# Altium project RTU_LMG.PrjPcb (part 2 of 3)

## Sheet RTU_LMG_Linear_Voltage_Regulator_3V3.SchDoc
size A; Organization: Altium Limited; Address1: L3, 12a Rodborough Rd; Address2: Frenchs Forest; Address3: NSW; Address4: Australia 2086; SheetNumber: 3; SheetTotal: 17
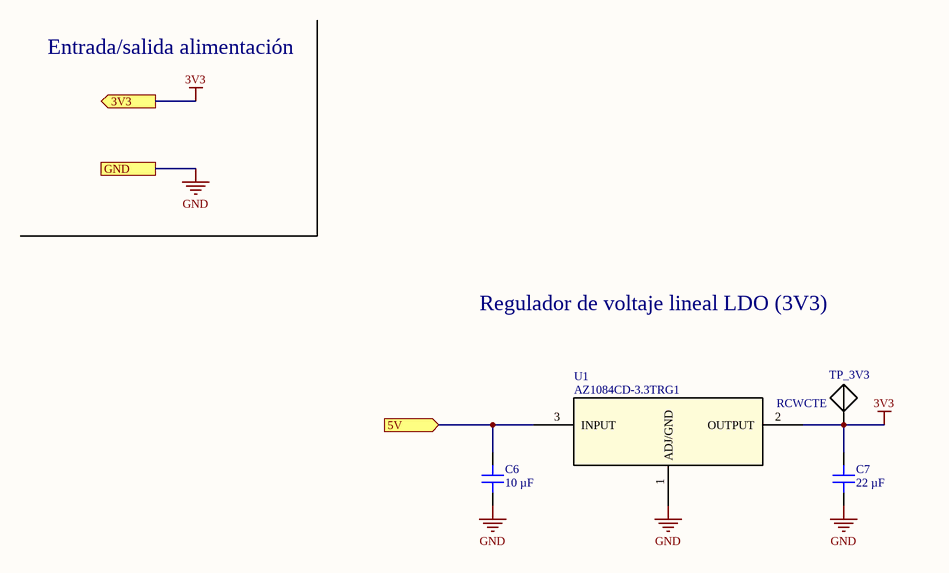
[diagram p6: RTU_LMG_Linear_Voltage_Regulator_3V3.SchDoc]

### Parts
C6  10 µF  [CAP 1210_3225 - 1MM]
C7  22 µF  [CAP 0805_2012]
TP_3V3  RCWCTE  [RCWCTE]
U1  AZ1084CD-3.3TRG1  [TO252-3]

### Ports
3V3 (out), 5V (in), GND

### Nets
3V3: C7.2 TP_3V3.1(TP) U1.2(OUTPUT) ; port 3V3
5V: C6.1 U1.3(INPUT) ; port 5V
GND: C6.2 C7.1 U1.1(ADJ/GND) ; port GND

### Notes on the sheet
- Entrada/salida alimentación
- Regulador de voltaje lineal LDO (3V3)
- Title
- Size:
- Date:
- A
- Number:
- Time:
- Revision:
- Sheet
- of

### Library data of the parts
C6 = C3225X7R1N106K250AC: CAP CER 10UF 75V X7R 1210; manufacturer: TDK Corporation; Tolerance: ±10%; Part Number: C3225X7R1N106K250AC; Value: 10 µF; Applications: General Purpose; Capacitance: 10 µF; componentlink1description: Datasheet; componentlink1url: https://product.tdk.com/info/en/catalog/datasheets/mlcc_commercial_general_en.pdf?ref_disty=digikey; componentlink2description: DigiKey Link; componentlink2url: https://www.digikey.com/en/products/detail/tdk-corporation/C3225X7R1N106K250AC/10413502; Device Package: 1210 (3225 Metric); Features: Low ESL; lastupdated: 10/29/2023 7:38:56 PM; Lifecycle Status: Active; Minimum Order: 1; Mounting Type: Surface Mount, MLCC; Operating Temperature: -55°C ~ 125°C; Package / Case: 1210 (3225 Metric); packaging: TapeAndReel; partid: 45109; Part Status: Active; price: 0.29; series: C; Size / Dimension: 0.126" L x 0.098" W (3.20mm x 2.50mm); Supplier 1: DigiKey; Supplier Part Number 1: 445-C3225X7R1N106K250ACCT-ND; Temperature Coefficient: X7R; Thickness (Max): 0.110" (2.80mm); Voltage - Rated: 75V
C7 = CL21A226MOCLRNC: CAP CER 22UF 16V X5R 0805; manufacturer: Samsung Electro-Mechanics; Tolerance: ±20%; Part Number: CL21A226MOCLRNC; Value: 22 µF; Applications: General Purpose; Capacitance: 22 µF; componentlink1description: Datasheet; componentlink1url: http://www.samsungsem.com/kr/support/product-search/mlcc/CL21A226MOCLRNC.jsp; componentlink2description: DigiKey Link; componentlink2url: https://www.digikey.com/en/products/detail/samsung-electro-mechanics/CL21A226MOCLRNC/5961264; Device Package: 0805 (2012 Metric); Features: Low Profile; lastupdated: 10/30/2023 7:14:19 PM; Lifecycle Status: Active; Minimum Order: 1; Mounting Type: Surface Mount, MLCC; Operating Temperature: -55°C ~ 85°C; Package / Case: 0805 (2012 Metric); packaging: TapeAndReel; partid: 4767; Part Status: Active; price: 0.05; series: CL; Size / Dimension: 0.079" L x 0.049" W (2.00mm x 1.25mm); Supplier 1: DigiKey; Supplier Part Number 1: 1276-6780-1-ND; Temperature Coefficient: X5R; Thickness (Max): 0.037" (0.95mm); Voltage - Rated: 16V
TP_3V3 = RCWCTE: - PC Test Point - - Plating Surface Mount Mounting Type; MF: KOA Speer; Check_prices: https://www.snapeda.com/parts/RCWCTE/KOA+Speer/view-part/?ref=eda; SnapEDA_Link: https://www.snapeda.com/parts/RCWCTE/KOA+Speer/view-part/?ref=snap; Digi-Key_Part_Number: 2019-RCWCTETR-ND; Value: *; Purchase-URL: https://pricing.snapeda.com/search/part/RCWCTE/?ref=eda; Package: None; MP: RCWCTE
U1 = AZ1084CD-3.3TRG1: Fuente regulada LDO - 3V3 - 5A; Mfr_Name: Diodes Inc; Copyright: Copyright (C) 2023 Ultra Librarian. All rights reserved.; Manufacturer_Part_Number: AZ1084CD-3.3TRG1; RefDes: RefDes; Type: DEV

## Sheet RTU_LMG_Linear_Voltage_Regulator_3V8.SchDoc
size A; Organization: Altium Limited; Address1: L3, 12a Rodborough Rd; Address2: Frenchs Forest; Address3: NSW; Address4: Australia 2086; SheetNumber: 4; SheetTotal: 17
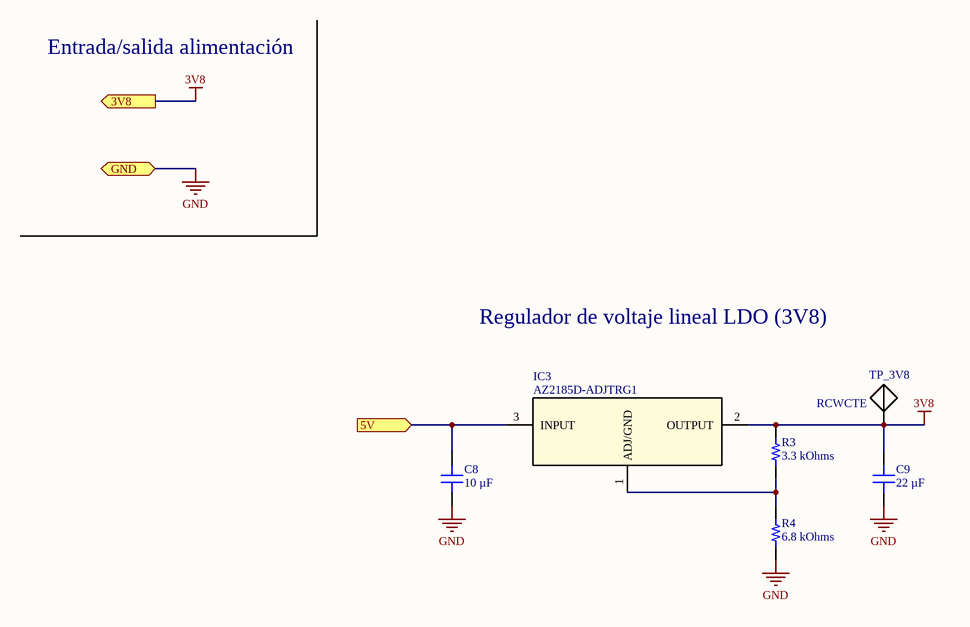
[diagram p7: RTU_LMG_Linear_Voltage_Regulator_3V8.SchDoc]

### Parts
C8  10 µF  [CAP 1210_3225 - 1MM]
C9  22 µF  [CAP 0805_2012]
IC3  AZ2185D-ADJTRG1  [TO252-3]
R3  3.3 kOhms  [RES 0603_1608]
R4  6.8 kOhms  [RES 0603_1608]
TP_3V8  RCWCTE  [RCWCTE]

### Ports
3V8 (out), 5V (in), GND (bidir)

### Nets
3V8: C9.2 IC3.2(OUTPUT) R3.2 TP_3V8.1(TP) ; port 3V8
5V: C8.1 IC3.3(INPUT) ; port 5V
GND: C8.2 C9.1 R4.1 ; port GND
NetIC3_1: IC3.1(ADJ/GND) R3.1 R4.2

### Notes on the sheet
- Entrada/salida alimentación
- Regulador de voltaje lineal LDO (3V8)
- Title
- Size:
- Date:
- A
- Number:
- Time:
- Revision:
- Sheet
- of

### Library data of the parts
C8 = C3225X7R1N106K250AC: as C6 on sheet RTU_LMG_Linear_Voltage_Regulator_3V3; Part Number: C3225X7R1N106K250AC; Value: 10 µF; Applications: General Purpose; Capacitance: 10 µF; componentlink1description: Datasheet; componentlink1url: https://product.tdk.com/info/en/catalog/datasheets/mlcc_commercial_general_en.pdf?ref_disty=digikey; componentlink2description: DigiKey Link; componentlink2url: https://www.digikey.com/en/products/detail/tdk-corporation/C3225X7R1N106K250AC/10413502; Device Package: 1210 (3225 Metric); Features: Low ESL; lastupdated: 10/29/2023 7:38:56 PM; Lifecycle Status: Active; Minimum Order: 1; Mounting Type: Surface Mount, MLCC; Operating Temperature: -55°C ~ 125°C; Package / Case: 1210 (3225 Metric); packaging: TapeAndReel; partid: 45109; Part Status: Active; price: 0.29; series: C; Size / Dimension: 0.126" L x 0.098" W (3.20mm x 2.50mm); Supplier 1: DigiKey; Supplier Part Number 1: 445-C3225X7R1N106K250ACCT-ND; Temperature Coefficient: X7R; Thickness (Max): 0.110" (2.80mm); Voltage - Rated: 75V
C9 = CL21A226MOCLRNC: as C7 on sheet RTU_LMG_Linear_Voltage_Regulator_3V3; Part Number: CL21A226MOCLRNC; Value: 22 µF; Applications: General Purpose; Capacitance: 22 µF; componentlink1description: Datasheet; componentlink1url: http://www.samsungsem.com/kr/support/product-search/mlcc/CL21A226MOCLRNC.jsp; componentlink2description: DigiKey Link; componentlink2url: https://www.digikey.com/en/products/detail/samsung-electro-mechanics/CL21A226MOCLRNC/5961264; Device Package: 0805 (2012 Metric); Features: Low Profile; lastupdated: 10/30/2023 7:14:19 PM; Lifecycle Status: Active; Minimum Order: 1; Mounting Type: Surface Mount, MLCC; Operating Temperature: -55°C ~ 85°C; Package / Case: 0805 (2012 Metric); packaging: TapeAndReel; partid: 4767; Part Status: Active; price: 0.05; series: CL; Size / Dimension: 0.079" L x 0.049" W (2.00mm x 1.25mm); Supplier 1: DigiKey; Supplier Part Number 1: 1276-6780-1-ND; Temperature Coefficient: X5R; Thickness (Max): 0.037" (0.95mm); Voltage - Rated: 16V
IC3 = AZ2185D-ADJTRG1: Fuente regulada LDO - 3V8 - 3A; Manufacturer_Name: Diodes Inc.; Datasheet Link: https://www.diodes.com/assets/Datasheets/AZ2185.pdf; Height: 2.39mm; Manufacturer_Part_Number: AZ2185D-ADJTRG1; Mouser Part Number: 621-AZ2185D-ADJTRG1; Mouser Price/Stock: https://www.mouser.co.uk/ProductDetail/Diodes-Incorporated/AZ2185D-ADJTRG1?qs=YCa%2FAAYMW022EhXzrDAtDg%3D%3D; Arrow Part Number: AZ2185D-ADJTRG1; Arrow Price/Stock: https://www.arrow.com/en/products/az2185d-adjtrg1/diodes-incorporated
R3 = CRGH0603F3K3: CRGH0603 1% 3K3 0.2W; Manufacturer: TE Connectivity Passive Product; Power (Watts): 0.2W, 1/5W; Temperature Coefficient: ±100ppm/°C; Part Number: CRGH0603F3K3; Value: 3.3 kOhms; ComponentLink1Description: Datasheet; ComponentLink1URL: https://www.te.com/commerce/DocumentDelivery/DDEController?Action=srchrtrv&DocNm=1773204-1&DocType=DS&DocLang=English; ComponentLink2Description: DigiKey Link; ComponentLink2URL: https://www.digikey.com/en/products/detail/te-connectivity-passive-product/CRGH0603F3K3/7495057; Composition: Thick Film; Device Package: 0603 (1608 Metric); Height - Seated (Max): 0.022" (0.55mm); LastUpdated: 10/31/2023 7:35:24 PM; Lifecycle Status: Active; Minimum Order: 1; Number of Terminations: 2; Operating Temperature: -55°C ~ 155°C; Package / Case: 0603 (1608 Metric); Packaging: TapeAndReel; PartId: 5686; Part Status: Active; Price: 0.01; Resistance: 3.3 kOhms; Series: CRGH, Neohm; Size / Dimension: 0.063" L x 0.031" W (1.60mm x 0.80mm); Supplier 1: DigiKey; Supplier Part Number 1: A129543CT-ND; Supplier Device Package: 0603; Tolerance: ±1%
R4 = CRGP0603F6K8: RES 6.8K OHM 1% 1/4W 0603; Manufacturer: TE Connectivity Passive Product; Power (Watts): 0.25W, 1/4W; Temperature Coefficient: ±100ppm/°C; Part Number: CRGP0603F6K8; Value: 6.8 kOhms; ComponentLink1Description: Datasheet; ComponentLink1URL: https://www.te.com/commerce/DocumentDelivery/DDEController?Action=srchrtrv&DocNm=9-1773463-9&DocType=DS&DocLang=English; ComponentLink2Description: DigiKey Link; ComponentLink2URL: https://www.digikey.com/en/products/detail/te-connectivity-passive-product/CRGP0603F6K8/8577028; Composition: Thick Film; Device Package: 0603 (1608 Metric); Features: Pulse Withstanding; Height - Seated (Max): 0.022" (0.55mm); LastUpdated: 10/31/2023 7:34:31 PM; Lifecycle Status: Active; Minimum Order: 1; Number of Terminations: 2; Operating Temperature: -55°C ~ 155°C; Package / Case: 0603 (1608 Metric); Packaging: TapeAndReel; PartId: 20908; Part Status: Active; Price: 0.01; Resistance: 6.8 kOhms; Series: CRGP; Size / Dimension: 0.063" L x 0.031" W (1.60mm x 0.80mm); Supplier 1: DigiKey; Supplier Part Number 1: A130426CT-ND; Supplier Device Package: 0603; Tolerance: ±1%
TP_3V8 = RCWCTE: as TP_3V3 on sheet RTU_LMG_Linear_Voltage_Regulator_3V3; Check_prices: https://www.snapeda.com/parts/RCWCTE/KOA+Speer/view-part/?ref=eda; SnapEDA_Link: https://www.snapeda.com/parts/RCWCTE/KOA+Speer/view-part/?ref=snap; Digi-Key_Part_Number: 2019-RCWCTETR-ND; Value: *; Purchase-URL: https://pricing.snapeda.com/search/part/RCWCTE/?ref=eda; Package: None; MP: RCWCTE

## Sheet RTU_LMG_ORing3V3.SchDoc
size A4; SheetNumber: 10; SheetTotal: 17
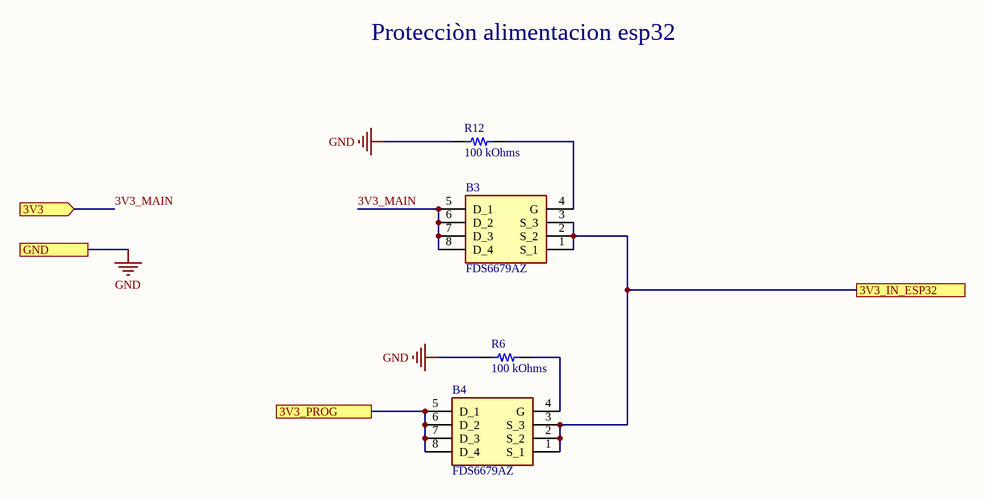
[diagram p8: RTU_LMG_ORing3V3.SchDoc]

### Parts
B3  FDS6679AZ  [SOIC127P600X175-8N]
B4  FDS6679AZ  [SOIC127P600X175-8N]
R6  100 kOhms  [RES 0603_1608]
R12  100 kOhms  [RES 0603_1608]

### Ports
3V3 (in), 3V3_IN_ESP32, 3V3_PROG, GND

### Nets
3V3_MAIN: B3.1(S_1) B3.2(S_2) B3.3(S_3) B3.5(D_1) B3.6(D_2) B3.7(D_3) B3.8(D_4) B4.1(S_1) B4.2(S_2) B4.3(S_3) ; port 3V3_IN_ESP32, port 3V3  [project net 3V3]
GND: R6.1 R12.1 ; port GND
VCCPROG: B4.5(D_1) B4.6(D_2) B4.7(D_3) B4.8(D_4) ; port 3V3_PROG
NetB3_4: B3.4(G) R12.2
NetB4_4: B4.4(G) R6.2

### Notes on the sheet
- Protecciòn alimentacion esp32

### Library data of the parts
B3 B4 = FDS6679AZ: as B1 on sheet RTU_LMG_Block_Diagram; Mouser Part Number: 512-FDS6679AZ; Mouser Price/Stock: https://www.mouser.co.uk/ProductDetail/onsemi-Fairchild/FDS6679AZ?qs=vnwGVgFuQiZlXnM8io%2FtYg%3D%3D; Manufacturer_Part_Number: FDS6679AZ; Datasheet Link: https://www.onsemi.com/pub/Collateral/FDS6679AZ-D.PDF
R6 R12 = RNCS0603BKE100K: RES 100K OHM 0.1% 1/16W 0603; Manufacturer: Stackpole Electronics Inc; Power (Watts): 0.063W, 1/16W; Temperature Coefficient: ±25ppm/°C; Part Number: RNCS0603BKE100K; Value: 100 kOhms; ComponentLink1Description: Datasheet; ComponentLink1URL: https://www.seielect.com/catalog/sei-rncs_rnch.pdf; ComponentLink2Description: DigiKey Link; ComponentLink2URL: https://www.digikey.com/en/products/detail/stackpole-electronics-inc/RNCS0603BKE100K/1708835; Composition: Thin Film; Device Package: 0603 (1608 Metric); Features: Anti-Corrosive, Automotive AEC-Q200, Moisture Resistant; Height - Seated (Max): 0.022" (0.55mm); LastUpdated: 9/2/2024 20:43:37; Lifecycle Status: Active; Minimum Order: 1; Number of Terminations: 2; Operating Temperature: -55°C ~ 155°C; Package / Case: 0603 (1608 Metric); Packaging: TapeAndReel; PartId: 4849; Part Status: Active; Price: 0.06; Ratings: AEC-Q200; Resistance: 100 kOhms; Series: RNCS; Size / Dimension: 0.061" L x 0.031" W (1.55mm x 0.80mm); Supplier 1: DigiKey; Supplier Part Number 1: RNCS0603BKE100KCT-ND; Supplier Device Package: 0603; Tolerance: ±0.1%

## Sheet RTU_LMG_RTC.SchDoc
size A4; SheetNumber: 9; SheetTotal: 16
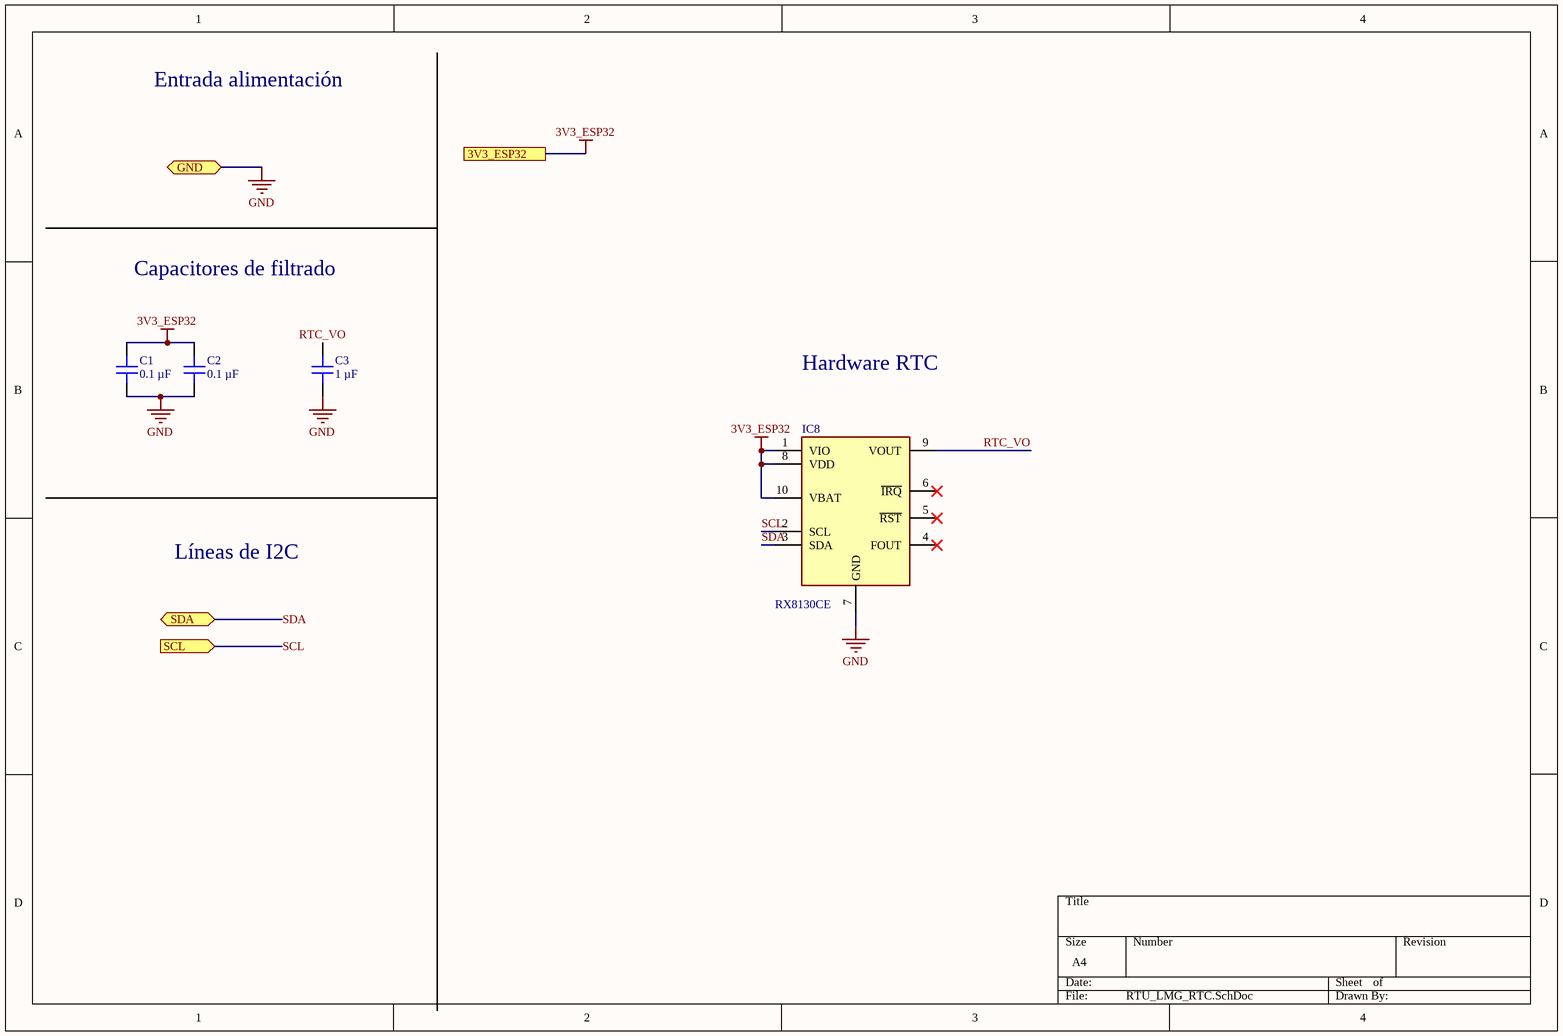
[diagram p9: RTU_LMG_RTC.SchDoc]

### Parts
C1  0.1 µF  [MURATA GRM155 0402_1005]
C2  0.1 µF  [MURATA GRM155 0402_1005]
C3  1 µF  [CAP 0402_1005]
IC8  RX8130CE  [RX8130CE]

### Ports
3V3_ESP32, GND (bidir), SCL (in), SDA (bidir)

### Nets
3V3_ESP32: C1.1 C2.1 IC8.1(VIO) IC8.8(VDD) IC8.10(VBAT) ; port 3V3_ESP32  [project net 3V3]
GND: C1.2 C2.2 C3.2 IC8.7(GND) ; port GND
RTC_VO: C3.1 IC8.9(VOUT)
SCL: IC8.2(SCL) ; port SCL
SDA: IC8.3(SDA) ; port SDA

Not connected (* = marked no-connect by the designer): IC8 4(FOUT)* 5(~{RST})* 6(~{IRQ})*

### Notes on the sheet
- Entrada alimentación
- Capacitores de filtrado
- Hardware RTC
- Líneas de I2C

### Library data of the parts
C1 C2 = GRM155R71H104KE14D: CAP CER 0.1UF 50V X7R 0402; manufacturer: Murata Electronics; Tolerance: ±10%; Part Number: GRM155R71H104KE14D; Value: 0.1 µF; Applications: General Purpose; Capacitance: 0.1 µF; componentlink1description: Datasheet; componentlink1url: https://search.murata.co.jp/Ceramy/image/img/A01X/G101/ENG/GRM155R71H104KE14-01.pdf; componentlink2description: DigiKey Link; componentlink2url: https://www.digikey.com/en/products/detail/murata-electronics/GRM155R71H104KE14D/4906220; Device Package: 0402 (1005 Metric); lastupdated: 8/27/2024 12:42:53 PM; Lifecycle Status: Active; Minimum Order: 1; Mounting Type: Surface Mount, MLCC; Operating Temperature: -55°C ~ 125°C; Package / Case: 0402 (1005 Metric); packaging: TapeAndReel; partid: 12677; Part Status: Active; price: 0.01; series: GRM; Size / Dimension: 0.039" L x 0.020" W (1.00mm x 0.50mm); Supplier 1: DigiKey; Supplier Part Number 1: 490-10700-1-ND; Temperature Coefficient: X7R; Thickness (Max): 0.022" (0.55mm); Voltage - Rated: 50V
C3 = CL05A105KO5NNNC: CAP CER 1UF 16V X5R 0402; manufacturer: Samsung Electro-Mechanics; Tolerance: ±10%; Part Number: CL05A105KO5NNNC; Value: 1 µF; Applications: General Purpose; Capacitance: 1 µF; componentlink1description: Datasheet; componentlink1url: http://www.samsungsem.com/kr/support/product-search/mlcc/CL05A105KO5NNNC.jsp; componentlink2description: DigiKey Link; componentlink2url: https://www.digikey.com/en/products/detail/samsung-electro-mechanics/CL05A105KO5NNNC/3886725; Device Package: 0402 (1005 Metric); lastupdated: 2/9/2024 8:04:35 PM; Lifecycle Status: Active; Minimum Order: 1; Mounting Type: Surface Mount, MLCC; Operating Temperature: -55°C ~ 85°C; Package / Case: 0402 (1005 Metric); packaging: TapeAndReel; partid: 3120; Part Status: Active; price: 0.01; series: CL; Size / Dimension: 0.039" L x 0.020" W (1.00mm x 0.50mm); Supplier 1: DigiKey; Supplier Part Number 1: 1276-1067-1-ND; Temperature Coefficient: X5R; Thickness (Max): 0.022" (0.55mm); Voltage - Rated: 16V
IC8 = RX8130CE: IC RTC CLK/CALENDAR I2C 10SMD; Manufacturer_Name: Epson Timing; Datasheet Link: https://www.mouser.in/Search/DownloadDatasheet?url=https%3A%2F%2Fwww.mouser.in%2Fdatasheet%2F2%2F137%2FRX8130CE_en-1825324.pdf; Height: 1mm; Manufacturer_Part_Number: RX8130CE; Arrow Part Number: RX8130CE; Arrow Price/Stock: https://www.arrow.com/en/products/rx8130ce/epson-electronics-america

## Sheet RTU_LMG_LoRa_Module.SchDoc
size A3; SheetNumber: 11; SheetTotal: 15
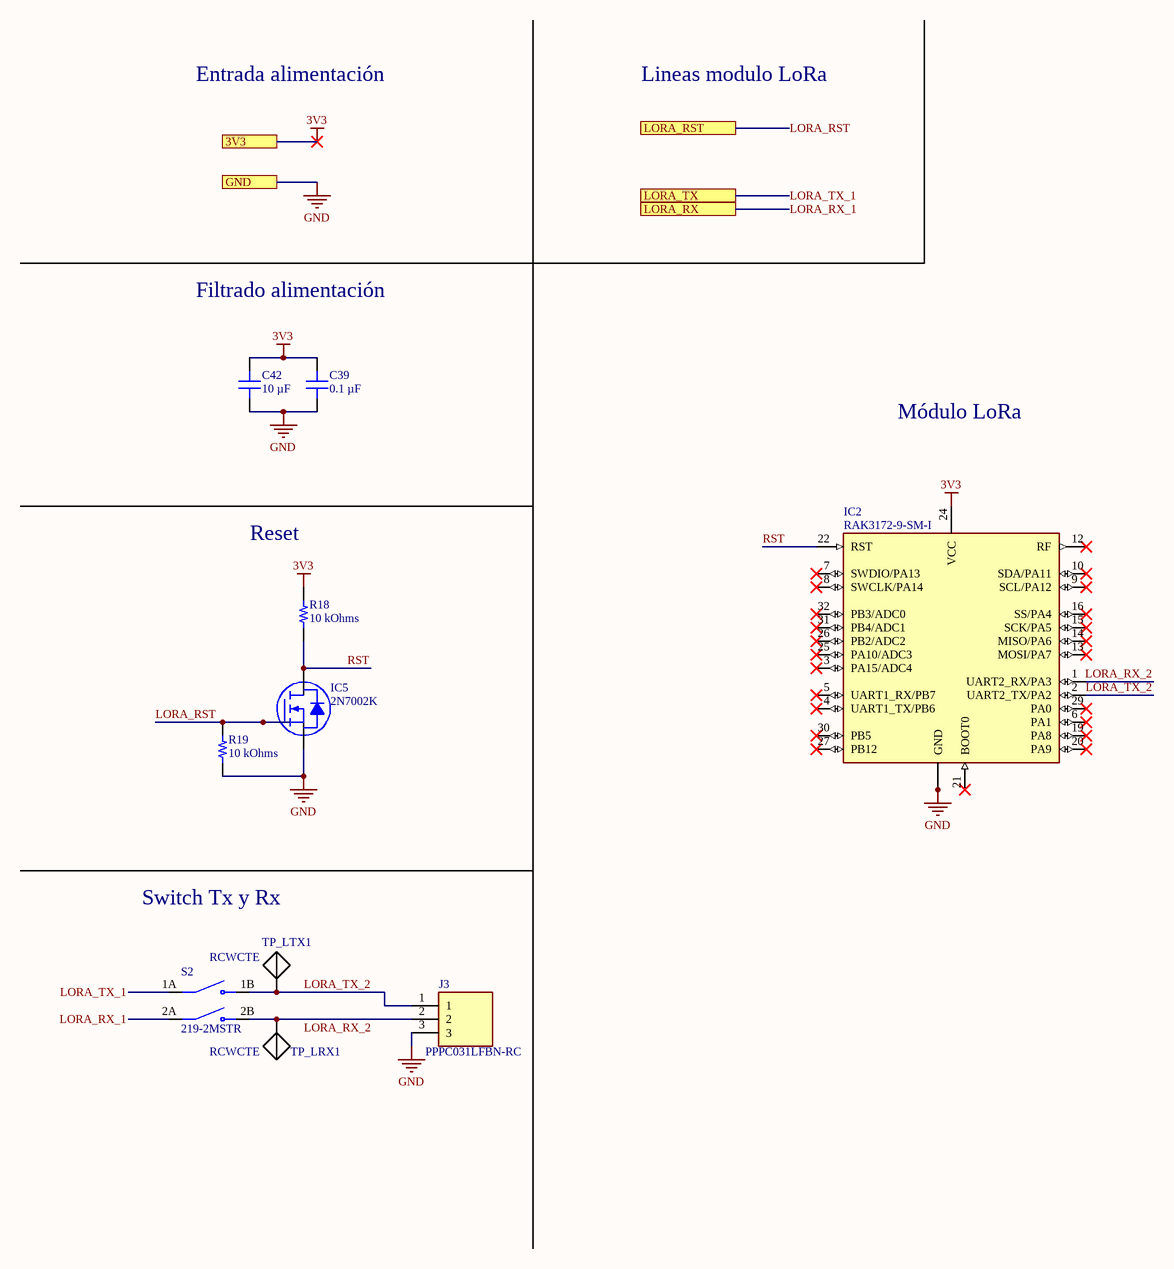
[diagram p10: RTU_LMG_LoRa_Module.SchDoc]

### Parts
C39  0.1 µF  [MURATA GRM155 0402_1005]
C42  10 µF  [CAP 0805_2012]
IC2  RAK3172-9-SM-I  [RAK3172-9-SM-I]
IC5  2N7002K  [ON SEMI SOT-23-3]
J3  PPPC031LFBN-RC  [PPPC031LFBN-RC]
R18  10 kOhms  [YAGEO RES 0603_1608]
R19  10 kOhms  [YAGEO RES 0603_1608]
S2  219-2MSTR  [SW_219-2MSTR]
TP_LRX1  RCWCTE  [RCWCTE]
TP_LTX1  RCWCTE  [RCWCTE]

### Ports
3V3, GND, LORA_RST, LORA_RX, LORA_TX

### Nets
3V3: C39.1 C42.2 IC2.24(VCC) R18.1 ; port 3V3
GND: C39.2 C42.1 IC2.11(GND) IC2.17(GND) IC2.18(GND) IC2.23(GND) IC2.28(GND) IC5.2(S) J3.3 R19.2 ; port GND
LORA_RST: IC5.1(G) R19.1 ; port LORA_RST
LORA_RX_1: S2.2A(COM2) ; port LORA_RX
LORA_RX_2: IC2.1(UART2_RX/PA3) J3.2 S2.2B(NO2) TP_LRX1.1(TP)
LORA_TX_1: S2.1A(COM1) ; port LORA_TX
LORA_TX_2: IC2.2(UART2_TX/PA2) J3.1 S2.1B(NO1) TP_LTX1.1(TP)
RST: IC2.22(RST) IC5.3(D) R18.2

Not connected (* = marked no-connect by the designer): IC2 3(PA15/ADC4)* 4(UART1_TX/PB6)* 5(UART1_RX/PB7)* 6(PA1)* 7(SWDIO/PA13)* 8(SWCLK/PA14)* 9(SCL/PA12)* 10(SDA/PA11)* 12(RF)* 13(MOSI/PA7)* 14(MISO/PA6)* 15(SCK/PA5)* 16(SS/PA4)* 19(PA8)* 20(PA9)* 21(BOOT0)* 25(PA10/ADC3)* 26(PB2/ADC2)* 27(PB12)* 29(PA0)* 30(PB5)* 31(PB4/ADC1)* 32(PB3/ADC0)*

### Notes on the sheet
- Entrada alimentación
- Lineas modulo LoRa
- Filtrado alimentación
- Módulo LoRa
- Reset
- Switch Tx y Rx

### Library data of the parts
C39 = GRM155R71H104KE14D: as C1 on sheet RTU_LMG_RTC; Part Number: GRM155R71H104KE14D; Value: 0.1 µF; Applications: General Purpose; Capacitance: 0.1 µF; componentlink1description: Datasheet; componentlink1url: https://search.murata.co.jp/Ceramy/image/img/A01X/G101/ENG/GRM155R71H104KE14-01.pdf; componentlink2description: DigiKey Link; componentlink2url: https://www.digikey.com/en/products/detail/murata-electronics/GRM155R71H104KE14D/4906220; Device Package: 0402 (1005 Metric); lastupdated: 8/27/2024 12:42:53 PM; Lifecycle Status: Active; Minimum Order: 1; Mounting Type: Surface Mount, MLCC; Operating Temperature: -55°C ~ 125°C; Package / Case: 0402 (1005 Metric); packaging: TapeAndReel; partid: 12677; Part Status: Active; price: 0.01; series: GRM; Size / Dimension: 0.039" L x 0.020" W (1.00mm x 0.50mm); Supplier 1: DigiKey; Supplier Part Number 1: 490-10700-1-ND; Temperature Coefficient: X7R; Thickness (Max): 0.022" (0.55mm); Voltage - Rated: 50V
C42 = CL21A106KOQNNNE: CAP CER 10UF 16V X5R 0805; manufacturer: Samsung Electro-Mechanics; Tolerance: ±10%; Part Number: CL21A106KOQNNNE; Value: 10 µF; Applications: General Purpose; Capacitance: 10 µF; componentlink1description: Datasheet; componentlink1url: http://www.samsungsem.com/kr/support/product-search/mlcc/CL21A106KOQNNNE.jsp; componentlink2description: DigiKey Link; componentlink2url: https://www.digikey.com/en/products/detail/samsung-electro-mechanics/CL21A106KOQNNNE/3886754; Device Package: 0805 (2012 Metric); lastupdated: 10/30/2023 7:13:57 PM; Lifecycle Status: Active; Minimum Order: 1; Mounting Type: Surface Mount, MLCC; Operating Temperature: -55°C ~ 85°C; Package / Case: 0805 (2012 Metric); packaging: TapeAndReel; partid: 14297; Part Status: Active; price: 0.01; series: CL; Size / Dimension: 0.079" L x 0.049" W (2.00mm x 1.25mm); Supplier 1: DigiKey; Supplier Part Number 1: 1276-1096-1-ND; Temperature Coefficient: X5R; Thickness (Max): 0.055" (1.40mm); Voltage - Rated: 16V
IC2 = RAK3172-9-SM-I: LoRaWAN module from RAK; MF: Shenzhen RAKwireless Technology Co.,Ltd.; Value: *; SnapEDA_Link: https://www.snapeda.com/parts/RAK3172/Shenzhen+RAKwireless+Technology+Co.%252CLtd./view-part/?ref=snap; Availability: Not in stock; Price: None; Package: Package; Check_prices: https://www.snapeda.com/parts/RAK3172/Shenzhen+RAKwireless+Technology+Co.%252CLtd./view-part/?ref=eda; MP: RAK3172-9-SM-I
IC5 = 2N7002K: MOSFET N-CH 60V 300MA SOT23; Manufacturer: ON Semiconductor; Current - Continuous Drain (Id) @ 25°C: 300mA (Ta); Drive Voltage (Max Rds On,  Min Rds On): 5V, 10V; FET Type: N-Channel; Input Capacitance (Ciss) (Max) @ Vds: 50pF @ 25V; Power Dissipation (Max): 350mW (Ta); Rds On (Max) @ Id, Vgs: 2Ohm @ 500mA, 10V; Vgs (Max): ±20V; Vgs(th) (Max) @ Id: 2.5V @ 250µA; Part Number: 2N7002K; ComponentLink1Description: Datasheet; ComponentLink1URL: https://www.onsemi.com/pub/Collateral/2N7002K-D.pdf; ComponentLink2Description: DigiKey Link; ComponentLink2URL: http://digikey.com/product-detail/en/on-semiconductor/2N7002K/2N7002KCT-ND/2060375; Drain to Source Voltage (Vdss): 60V; LastUpdated: 3/11/2024 8:04:14 AM; Lifecycle Status: Active; Minimum Order: 1; Mounting Type: Surface Mount; Operating Temperature: -55°C ~ 150°C (TJ); Package / Case: TO-236-3, SC-59, SOT-23-3; Packaging: TapeAndReel; Part Status: Active; Price: 0.07; Series: -; Supplier 1: DigiKey; Supplier Part Number 1: 2N7002KCT-ND; Supplier Device Package: SOT-23 (TO-236AB); Technology: MOSFET (Metal Oxide)
J3 = PPPC031LFBN-RC: Connector; Manufacturer_Name: Sullins; Datasheet Link: http://www.sullinscorp.com/drawings/78_P(N)PxCxxxLFBN-RC,_10492-H.pdf; Height: 8.5mm; Manufacturer_Part_Number: PPPC031LFBN-RC
R18 R19 = RC0603FR-0710KL: RES 10K OHM 1% 1/10W 0603; Manufacturer: Yageo; Power (Watts): 0.1W, 1/10W; Temperature Coefficient: ±100ppm/°C; Part Number: RC0603FR-0710KL; Value: 10 kOhms; ComponentLink1Description: Datasheet; ComponentLink1URL: https://www.yageo.com/upload/media/product/productsearch/datasheet/rchip/PYu-RC_Group_51_RoHS_L_10.pdf; ComponentLink2Description: DigiKey Link; ComponentLink2URL: https://www.digikey.com/en/products/detail/yageo/RC0603FR-0710KL/726880; Composition: Thick Film; Device Package: 0603 (1608 Metric); Features: Moisture Resistant; Height - Seated (Max): 0.022" (0.55mm); LastUpdated: 7/25/2024 9:19:19 AM; Lifecycle Status: Active; Minimum Order: 1; Number of Terminations: 2; Operating Temperature: -55°C ~ 155°C; Package / Case: 0603 (1608 Metric); Packaging: CutTape; PartId: 22599; Part Status: Active; Price: 0.01; Resistance: 10 kOhms; Series: RC_L; Size / Dimension: 0.063" L x 0.031" W (1.60mm x 0.80mm); Supplier 1: DigiKey; Supplier Part Number 1: 311-10.0KHRCT-ND; Supplier Device Package: 0603; Tolerance: ±1%
S2 = 219-2MSTR: Dip Switch SPST 2 Position Surface Mount Slide (Standard) Actuator 100mA 20VDC; MF: CTS Electrocomponents; SnapEDA_Link: https://www.snapeda.com/parts/219-2MSTR/CTS+Components/view-part/?ref=snap; Package: None; Value: *; MP: 219-2MSTR; Check_prices: https://www.snapeda.com/parts/219-2MSTR/CTS+Components/view-part/?ref=eda
TP_LRX1 TP_LTX1 = RCWCTE: as TP_3V3 on sheet RTU_LMG_Linear_Voltage_Regulator_3V3; Check_prices: https://www.snapeda.com/parts/RCWCTE/KOA+Speer/view-part/?ref=eda; SnapEDA_Link: https://www.snapeda.com/parts/RCWCTE/KOA+Speer/view-part/?ref=snap; Digi-Key_Part_Number: 2019-RCWCTETR-ND; Value: *; Purchase-URL: https://pricing.snapeda.com/search/part/RCWCTE/?ref=eda; Package: None; MP: RCWCTE

## Sheet RTU_LMG_Battery_Charger.SchDoc
size A4; SheetNumber: 12; SheetTotal: 15
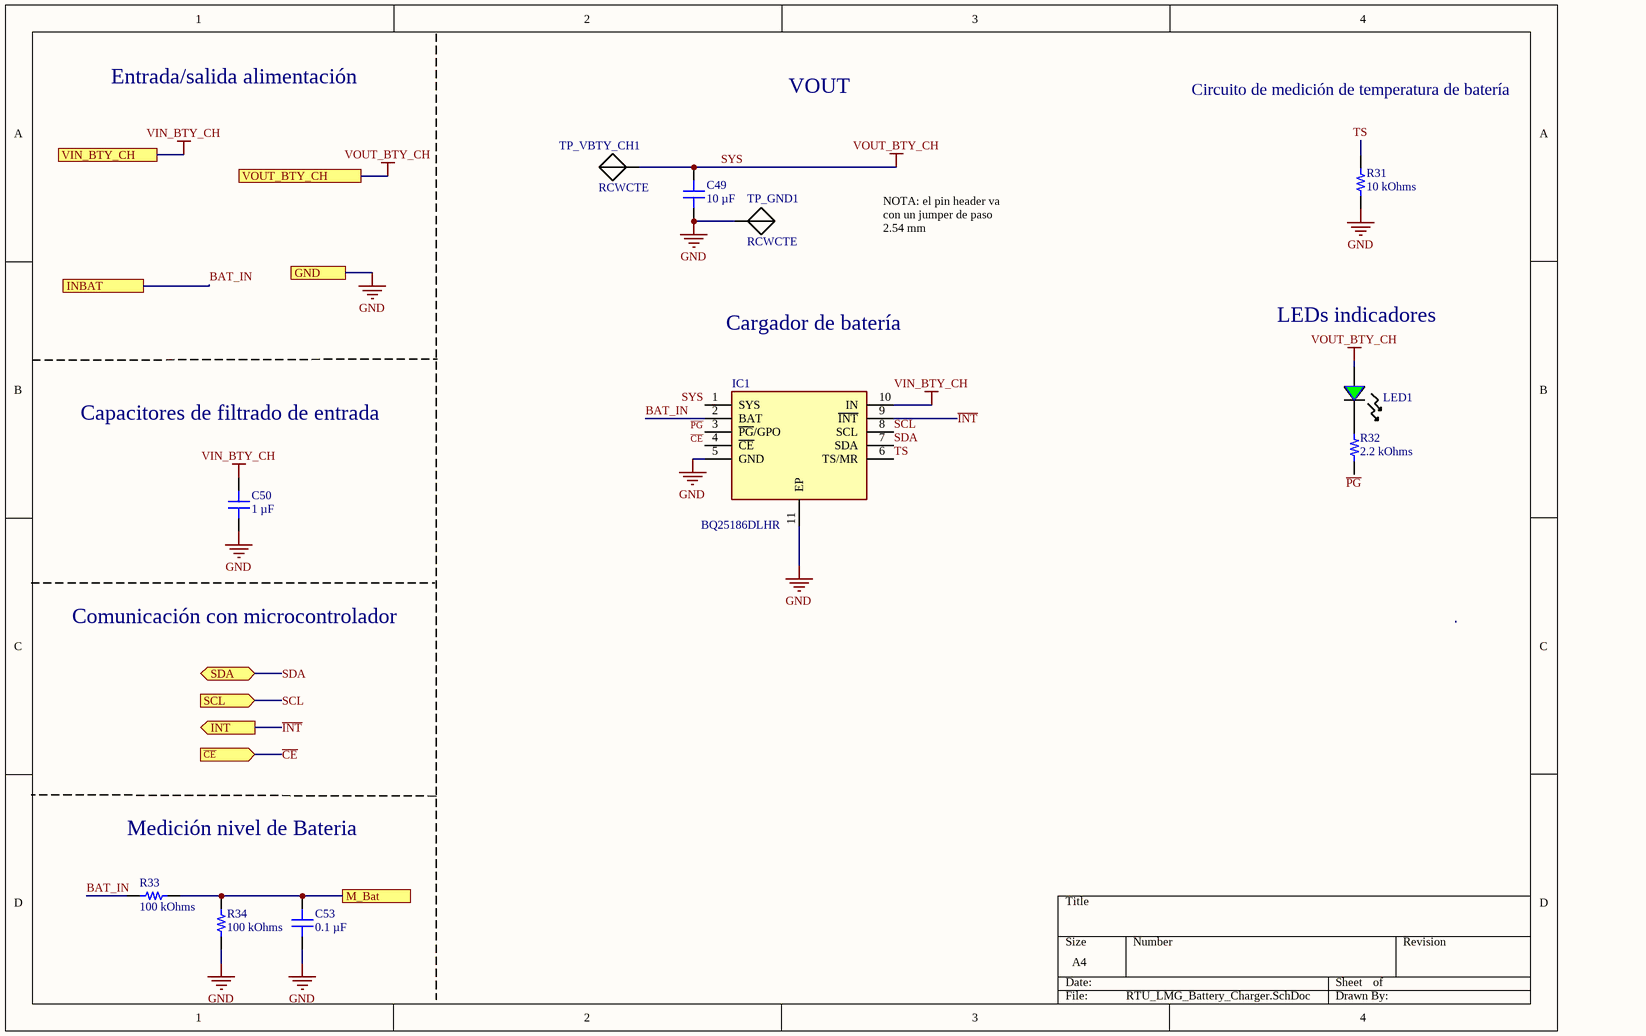
[diagram p11: RTU_LMG_Battery_Charger.SchDoc]

### Parts
C49  10 µF  [CAP 0805_2012]
C50  1 µF  [MURATA GRM155 0402_1005]
C53  0.1 µF  [CAP 0402_1005]
IC1  BQ25186DLHR  [SON40P220X200X80-11N]
LED1  LTST-C170GKT  [0805 SMD - LED]  (value not drawn)
R31  10 kOhms  [RES 0603_1608]
R32  2.2 kOhms  [RES 0402_1005]
R33  100 kOhms  [RES 0402_1005]
R34  100 kOhms  [RES 0402_1005]
TP_GND1  RCWCTE  [RCWCTE]
TP_VBTY_CH1  RCWCTE  [RCWCTE]

### Ports
GND, INBAT, INT (out), M_Bat, SCL (in), SDA (bidir), VIN_BTY_CH, VOUT_BTY_CH, ~{CE} (in)

### Nets
GND: C49.2 C50.1 C53.1 IC1.5(GND) IC1.11(EP) R31.1 R34.2 TP_GND1.1(TP) ; port GND
SYS: C49.1 IC1.1(SYS) LED1.A(ANODE) TP_VBTY_CH1.1(TP) ; port VOUT_BTY_CH  [also labelled VOUT_BTY_CH]  [project net 5V]
VIN_BTY_CH: C50.2 IC1.10(IN) ; port VIN_BTY_CH
~{CE}: IC1.4(~{CE}) ; port ~{CE}
~{INT}: IC1.9(~{INT}) ; port INT
~{PG}: IC1.3(~{PG}/GPO) R32.1
BAT_IN: IC1.2(BAT) R33.1 ; port INBAT
MBAT: C53.2 R33.2 R34.1 ; port M_Bat
SCL: IC1.8(SCL) ; port SCL
SDA: IC1.7(SDA) ; port SDA
TS: IC1.6(TS/MR) R31.2
NetLED1_K: LED1.K(CATHODE) R32.2

### Notes on the sheet
- Entrada/salida alimentación
- VOUT
- Circuito de medición de temperatura de batería
- NOTA: el pin header va con un jumper de paso 2.54 mm
- Cargador de batería
- (near LED1) LEDs indicadores
- Capacitores de filtrado de entrada
- Comunicación con microcontrolador
- Medición nivel de Bateria

### Library data of the parts
C49 = CL21A106KOQNNNE: as C42 on sheet RTU_LMG_LoRa_Module; Part Number: CL21A106KOQNNNE; Value: 10 µF; Applications: General Purpose; Capacitance: 10 µF; componentlink1description: Datasheet; componentlink1url: http://www.samsungsem.com/kr/support/product-search/mlcc/CL21A106KOQNNNE.jsp; componentlink2description: DigiKey Link; componentlink2url: https://www.digikey.com/en/products/detail/samsung-electro-mechanics/CL21A106KOQNNNE/3886754; Device Package: 0805 (2012 Metric); lastupdated: 10/30/2023 7:13:57 PM; Lifecycle Status: Active; Minimum Order: 1; Mounting Type: Surface Mount, MLCC; Operating Temperature: -55°C ~ 85°C; Package / Case: 0805 (2012 Metric); packaging: TapeAndReel; partid: 14297; Part Status: Active; price: 0.01; series: CL; Size / Dimension: 0.079" L x 0.049" W (2.00mm x 1.25mm); Supplier 1: DigiKey; Supplier Part Number 1: 1276-1096-1-ND; Temperature Coefficient: X5R; Thickness (Max): 0.055" (1.40mm); Voltage - Rated: 16V
C50 = GRM155R6YA105KE11D: CAP CER 1UF 35V X5R 0402; manufacturer: Murata Electronics; Tolerance: ±10%; Part Number: GRM155R6YA105KE11D; Value: 1 µF; Applications: General Purpose; Capacitance: 1 µF; componentlink1description: Datasheet; componentlink1url: https://search.murata.co.jp/Ceramy/image/img/A01X/G101/ENG/GRM155R6YA105KE11-01.pdf; componentlink2description: DigiKey Link; componentlink2url: https://www.digikey.com/en/products/detail/murata-electronics/GRM155R6YA105KE11D/4905162; Device Package: 0402 (1005 Metric); lastupdated: 8/27/2024 12:42:54 PM; Lifecycle Status: Active; Minimum Order: 1; Mounting Type: Surface Mount, MLCC; Operating Temperature: -55°C ~ 85°C; Package / Case: 0402 (1005 Metric); packaging: TapeAndReel; partid: 4167; Part Status: Active; price: 0.01; series: GRM; Size / Dimension: 0.039" L x 0.020" W (1.00mm x 0.50mm); Supplier 1: DigiKey; Supplier Part Number 1: 490-10019-1-ND; Temperature Coefficient: X5R; Thickness (Max): 0.024" (0.60mm); Voltage - Rated: 35V
C53 = CGA2B3X5R1H104M050BB: CAP CER 0.1UF 50V X5R 0402; manufacturer: TDK Corporation; Tolerance: ±20%; Part Number: CGA2B3X5R1H104M050BB; Capacitance: 0.1 µF; Applications: Automotive; componentlink1description: Datasheet; componentlink1url: https://product.tdk.com/info/en/catalog/datasheets/mlcc_automotive_general_en.pdf?ref_disty=digikey; componentlink2description: DigiKey Link; componentlink2url: https://www.digikey.com/en/products/detail/tdk-corporation/CGA2B3X5R1H104M050BB/3949450; Device Package: 0402 (1005 Metric); lastupdated: 9/2/2024 20:04:38; Lifecycle Status: Active; Minimum Order: 1; Mounting Type: Surface Mount, MLCC; Operating Temperature: -55°C ~ 85°C; Package / Case: 0402 (1005 Metric); packaging: TapeAndReel; partid: 1792; Part Status: Active; price: 0.01; Ratings: AEC-Q200; series: CGA; Size / Dimension: 0.039" L x 0.020" W (1.00mm x 0.50mm); Supplier 1: DigiKey; Supplier Part Number 1: 445-12214-1-ND; Temperature Coefficient: X5R; Thickness (Max): 0.022" (0.55mm); value: 0.1 µF; Voltage - Rated: 50V
IC1 = BQ25186DLHR: BQ25186 1-Cell, 1A I2C Linear Battery Charger with Power Path, Ship Mode, Shutdown Mode, and Battery Tracking VINDPM; Manufacturer_Name: Texas Instruments; Geometry.Height: 0.8mm; Mouser Part Number: 595-BQ25186DLHR; Mouser Price/Stock: https://www.mouser.co.uk/ProductDetail/Texas-Instruments/BQ25186DLHR?qs=efUn273yAheZpfz2mNbAWQ%3D%3D; Manufacturer_Part_Number: BQ25186DLHR; Datasheet Link: https://www.ti.com/lit/ds/symlink/bq25186.pdf?ts=1740508135755&ref_url=https%253A%252F%252Fwww.ti.com%252Fproduct%252FBQ25186
LED1 = LTST-C170GKT: LED verde SMD (0805); Mfr_Name: Wolfspeed; Type: DEV; Copyright: Copyright (C) 2023 Ultra Librarian. All rights reserved.; Manufacturer_Part_Number: LTST-C170GKT; RefDes: RefDes
R31 = RC0603FR-0710KL: as R18 on sheet RTU_LMG_LoRa_Module; Part Number: RC0603FR-0710KL; Value: 10 kOhms; ComponentLink1Description: Datasheet; ComponentLink1URL: https://www.yageo.com/upload/media/product/productsearch/datasheet/rchip/PYu-RC_Group_51_RoHS_L_10.pdf; ComponentLink2Description: DigiKey Link; ComponentLink2URL: https://www.digikey.com/en/products/detail/yageo/RC0603FR-0710KL/726880; Composition: Thick Film; Device Package: 0603 (1608 Metric); Features: Moisture Resistant; Height - Seated (Max): 0.022" (0.55mm); LastUpdated: 10/30/2023 7:36:43 PM; Lifecycle Status: Active; Minimum Order: 1; Number of Terminations: 2; Operating Temperature: -55°C ~ 155°C; Package / Case: 0603 (1608 Metric); Packaging: CutTape; PartId: 22599; Part Status: Active; Price: 0.01; Resistance: 10 kOhms; Series: RC_L; Size / Dimension: 0.063" L x 0.031" W (1.60mm x 0.80mm); Supplier 1: DigiKey; Supplier Part Number 1: 311-10.0KHRCT-ND; Supplier Device Package: 0603; Tolerance: ±1%
R32 = ERJ-2RKF2201X: RES SMD 2.2K OHM 1% 1/10W 0402; Manufacturer: Panasonic Electronic Components; Power (Watts): 0.1W, 1/10W; Temperature Coefficient: ±100ppm/°C; Part Number: ERJ-2RKF2201X; Value: 2.2 kOhms; ComponentLink1Description: Datasheet; ComponentLink1URL: https://industrial.panasonic.com/cdbs/www-data/pdf/RDA0000/AOA0000C304.pdf; ComponentLink2Description: DigiKey Link; ComponentLink2URL: https://www.digikey.com/en/products/detail/panasonic-electronic-components/ERJ-2RKF2201X/1746150; Composition: Thick Film; Device Package: 0402 (1005 Metric); Features: Automotive AEC-Q200; Height - Seated (Max): 0.016" (0.40mm); LastUpdated: 10/30/2023 7:25:42 PM; Lifecycle Status: Active; Minimum Order: 1; Number of Terminations: 2; Operating Temperature: -55°C ~ 155°C; Package / Case: 0402 (1005 Metric); Packaging: CutTape; PartId: 19620; Part Status: Active; Price: 0.01; Ratings: AEC-Q200; Resistance: 2.2 kOhms; Series: ERJ-2RK; Size / Dimension: 0.039" L x 0.020" W (1.00mm x 0.50mm); Supplier 1: DigiKey; Supplier Part Number 1: P2.20KLCT-ND; Supplier Device Package: 0402; Tolerance: ±1%
R33 R34 = CRCW0402100KFKED: RES SMD 100K OHM 1% 1/16W 0402; Manufacturer: Vishay Dale; Power (Watts): 0.063W, 1/16W; Temperature Coefficient: ±100ppm/°C; Part Number: CRCW0402100KFKED; Value: 100 kOhms; ComponentLink1Description: Datasheet; ComponentLink1URL: http://www.vishay.com/docs/20035/dcrcwe3.pdf; ComponentLink2Description: DigiKey Link; ComponentLink2URL: https://www.digikey.com/en/products/detail/vishay-dale/CRCW0402100KFKED/1178235; Composition: Thick Film; Device Package: 0402 (1005 Metric); Features: Automotive AEC-Q200; Height - Seated (Max): 0.016" (0.40mm); LastUpdated: 11/2/2023 7:33:14 PM; Lifecycle Status: Active; Minimum Order: 1; Number of Terminations: 2; Operating Temperature: -55°C ~ 155°C; Package / Case: 0402 (1005 Metric); Packaging: CutTape; PartId: 11959; Part Status: Active; Price: 0.01; Ratings: AEC-Q200; Resistance: 100 kOhms; Series: CRCW; Size / Dimension: 0.039" L x 0.020" W (1.00mm x 0.50mm); Supplier 1: DigiKey; Supplier Part Number 1: 541-100KLCT-ND; Supplier Device Package: 0402; Tolerance: ±1%
TP_GND1 TP_VBTY_CH1 = RCWCTE: as TP_3V3 on sheet RTU_LMG_Linear_Voltage_Regulator_3V3; Check_prices: https://www.snapeda.com/parts/RCWCTE/KOA+Speer/view-part/?ref=eda; SnapEDA_Link: https://www.snapeda.com/parts/RCWCTE/KOA+Speer/view-part/?ref=snap; Digi-Key_Part_Number: 2019-RCWCTETR-ND; Value: *; Purchase-URL: https://pricing.snapeda.com/search/part/RCWCTE/?ref=eda; Package: None; MP: RCWCTE

## Sheet RTU_LMG_LM2596.SchDoc
size A4; SheetNumber: 13; SheetTotal: 17
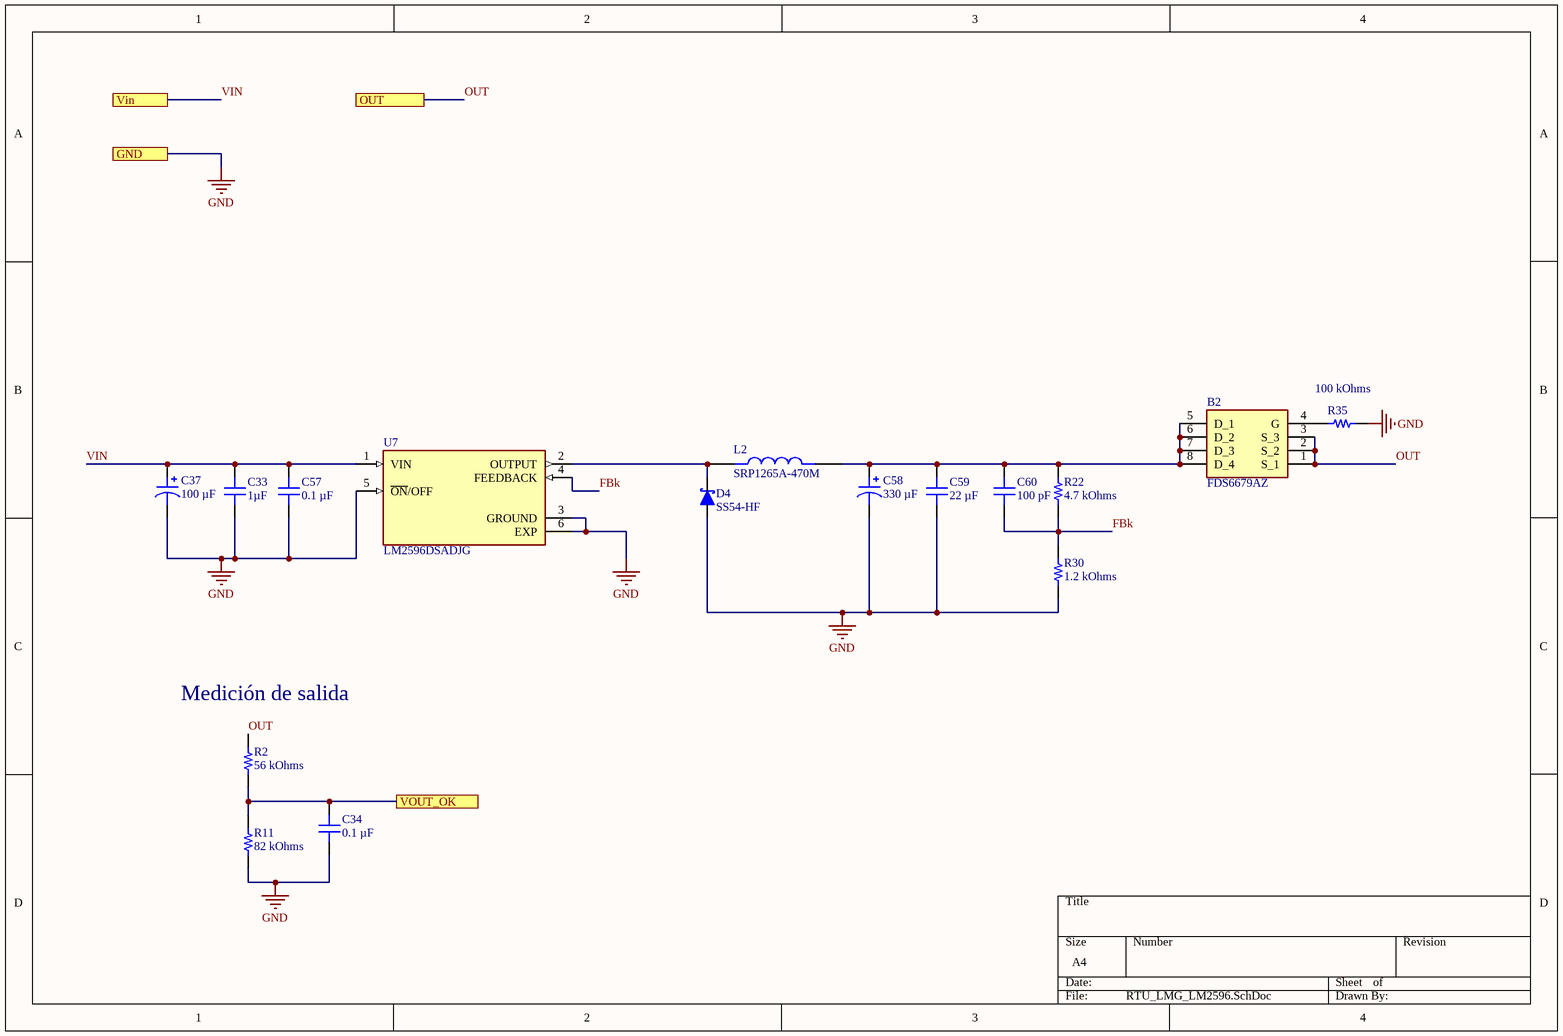
[diagram p12: RTU_LMG_LM2596.SchDoc]

### Parts
B2  FDS6679AZ  [SOIC127P600X175-8N]
C33  1µF  [CAP 0603_1608]
C34  0.1 µF  [CAP 0402_1005]
C37  100 µF  [CAP ALSMD POLY 8.3MM H10.5MM]
C57  0.1 µF  [CAP 0402_1005]
C58  330 µF  [CAP ALSMD 8.3MM H10.5MM]
C59  22 µF  [CAP 0603_1608]
C60  100 pF  [CAP 0603_1608]
D4  SS54-HF  [DIOM5025X220N]
L2  SRP1265A-470M  [IND_SRP1265A-470M]
R2  56 kOhms  [YAGEO RES 0402_1005]
R11  82 kOhms  [YAGEO RES 0402_1005]
R22  4.7 kOhms  [YAGEO RES 0603_1608]
R30  1.2 kOhms  [YAGEO RES 0603_1608]
R35  100 kOhms  [RES 0603_1608]
U7  LM2596DSADJG  [CONV_LM2596DSADJG]

### Ports
GND, OUT, Vin, VOUT_OK

### Nets
GND: C33.1 C34.1 C37.2 C57.1 C58.2 C59.1 D4.2(A) R11.1 R30.1 R35.2 U7.3(GROUND) U7.5(~{ON}/OFF) U7.6(EXP) ; port GND
OUT: B2.1(S_1) B2.2(S_2) B2.3(S_3) R2.2 ; port OUT  [project net VIN_BTY_CH]
VIN: C33.2 C37.1 C57.2 U7.1(VIN) ; port Vin  [project net VCC_TRACT]
FBk: C60.1 R22.1 R30.2 U7.4(FEEDBACK)
VOUT_OK: C34.2 R2.1 R11.2 ; port VOUT_OK
NetB2_4: B2.4(G) R35.1
NetB2_5: B2.5(D_1) B2.6(D_2) B2.7(D_3) B2.8(D_4) C58.1 C59.2 C60.2 L2.2 R22.2
NetD4_1: D4.1(K) L2.1 U7.2(OUTPUT)

### Notes on the sheet
- (near R2) Medición de salida

### Library data of the parts
B2 = FDS6679AZ: as B1 on sheet RTU_LMG_Block_Diagram; Mouser Part Number: 512-FDS6679AZ; Mouser Price/Stock: https://www.mouser.co.uk/ProductDetail/onsemi-Fairchild/FDS6679AZ?qs=vnwGVgFuQiZlXnM8io%2FtYg%3D%3D; Manufacturer_Part_Number: FDS6679AZ; Datasheet Link: https://www.onsemi.com/pub/Collateral/FDS6679AZ-D.PDF; ComponentLink1Description: New link; ComponentLink1URL: https://ar.mouser.com/ProductDetail/onsemi-Fairchild/FDS6679AZ?qs=vnwGVgFuQiZlXnM8io%2FtYg%3D%3D; ComponentLink2Description: New link; ComponentLink2URL: https://www.digikey.com/en/products/detail/umw/FDS6679AZ/24889652
C33 = 06035D105MAT2A: CAP CER 1UF 50V X5R 0603; manufacturer: AVX Corporation; Tolerance: ±20%; Part Number: 06035D105MAT2A; Capacitance: 1µF; Applications: General Purpose; componentlink1description: Datasheet; componentlink1url: http://datasheets.avx.com/cx5r.pdf; componentlink2description: DigiKey Link; componentlink2url: http://digikey.com/product-detail/en/avx-corporation/06035D105MAT2A/478-11443-1-ND/8019298; Device Package: 0603 (1608 Metric); lastupdated: 2/9/2020 01:03:34; Lifecycle Status: Active; Minimum Order: 1; Mounting Type: Surface Mount, MLCC; Operating Temperature: -55°C ~ 85°C; Package / Case: 0603 (1608 Metric); packaging: TapeAndReel; partid: 3200; Part Status: Active; price: 0.05; series: -; Size / Dimension: 0.063" L x 0.032" W (1.60mm x 0.81mm); Supplier 1: DigiKey; Supplier Part Number 1: 478-11443-1-ND; Temperature Coefficient: X5R; Thickness (Max): 0.035" (0.90mm); value: 1µF; Voltage - Rated: 50V
C34 C57 = CGA2B3X5R1H104M050BB: as C53 on sheet RTU_LMG_Battery_Charger; Part Number: CGA2B3X5R1H104M050BB; Capacitance: 0.1 µF; Applications: Automotive; componentlink1description: Datasheet; componentlink1url: https://product.tdk.com/info/en/catalog/datasheets/mlcc_automotive_general_en.pdf?ref_disty=digikey; componentlink2description: DigiKey Link; componentlink2url: https://www.digikey.com/en/products/detail/tdk-corporation/CGA2B3X5R1H104M050BB/3949450; Device Package: 0402 (1005 Metric); lastupdated: 9/2/2024 20:04:38; Lifecycle Status: Active; Minimum Order: 1; Mounting Type: Surface Mount, MLCC; Operating Temperature: -55°C ~ 85°C; Package / Case: 0402 (1005 Metric); packaging: TapeAndReel; partid: 1792; Part Status: Active; price: 0.01; Ratings: AEC-Q200; series: CGA; Size / Dimension: 0.039" L x 0.020" W (1.00mm x 0.50mm); Supplier 1: DigiKey; Supplier Part Number 1: 445-12214-1-ND; Temperature Coefficient: X5R; Thickness (Max): 0.022" (0.55mm); value: 0.1 µF; Voltage - Rated: 50V
C37 = HHXD350ARA101MHA0G: CAP ALUM HYBRD 100UF 20% 35V SMD; manufacturer: United Chemi-Con; ESR (Equivalent Series Resistance): 27mOhm; Lifetime @ Temp.: 5000 Hrs @ 105°C; Ripple Current @ High Frequency: 2.3 A @ 100 kHz; Ripple Current @ Low Frequency: 230 mA @ 120 Hz; Surface Mount Land Size: 0.327" L x 0.327" W (8.30mm x 8.30mm); Type: Hybrid; Part Number: HHXD350ARA101MHA0G; Applications: Automotive; Capacitance: 100 µF; componentlink1description: Datasheet; componentlink1url: http://www.chemi-con.co.jp/cgi-bin/CAT_DB/SEARCH/cat_db_al.cgi?e=e&j=p&pdfname=hxd; componentlink2description: DigiKey Link; componentlink2url: https://www.digikey.com/en/products/detail/united-chemi-con/HHXD350ARA101MHA0G/10486549; Device Package: Radial, Can - SMD; Height - Seated (Max): 0.413" (10.50mm); lastupdated: 3/6/2024 20:17:04; Lifecycle Status: Active; Minimum Order: 1; Mounting Type: Surface Mount; Operating Temperature: -55°C ~ 105°C; Package / Case: Radial, Can - SMD; packaging: TapeAndReel; partid: 2061; Part Status: Active; price: 0.51; Ratings: AEC-Q200; series: HXD; Size / Dimension: 0.315" Dia (8.00mm); Supplier 1: DigiKey; Supplier Part Number 1: 565-HHXD350ARA101MHA0GCT-ND; Tolerance: ±20%; value: 100 µF; Voltage - Rated: 35 V
C58 = 865060353008: CAP ALUM 330UF 20% 16V SMD; manufacturer: Würth Elektronik; Impedance: 170 mOhms; Lifetime @ Temp.: 5000 Hrs @ 105°C; Polarization: Polar; Ripple Current @ High Frequency: 550 mA @ 100 kHz; Ripple Current @ Low Frequency: 357.5 mA @ 120 Hz; Surface Mount Land Size: 0.327" L x 0.327" W (8.30mm x 8.30mm); Part Number: 865060353008; Applications: General Purpose; Capacitance: 330 µF; componentlink1description: Datasheet; componentlink1url: https://katalog.we-online.de/pbs/datasheet/865060353008.pdf; componentlink2description: DigiKey Link; componentlink2url: https://www.digikey.com/en/products/detail/würth-elektronik/865060353008/5728120; Device Package: Radial, Can - SMD; Height - Seated (Max): 0.413" (10.50mm); lastupdated: 3/6/2024 20:15:49; Lifecycle Status: Active; Minimum Order: 1; Mounting Type: Surface Mount; Operating Temperature: -55°C ~ 105°C; Package / Case: Radial, Can - SMD; packaging: TapeAndReel; partid: 7463; Part Status: Active; price: 0.39; series: WCAP-ASLL; Size / Dimension: 0.315" Dia (8.00mm); Supplier 1: DigiKey; Supplier Part Number 1: 732-8525-1-ND; Tolerance: ±20%; value: 330 µF; Voltage - Rated: 16 V
C59 = C1608X5R1A226M080AC: CAP CER 22UF 10V X5R 0603; manufacturer: TDK Corporation; Tolerance: ±20%; Part Number: C1608X5R1A226M080AC; Capacitance: 22 µF; Applications: General Purpose; componentlink1description: Datasheet; componentlink1url: https://product.tdk.com/info/en/catalog/datasheets/mlcc_commercial_general_en.pdf?ref_disty=digikey; componentlink2description: DigiKey Link; componentlink2url: https://www.digikey.com/en/products/detail/tdk-corporation/C1608X5R1A226M080AC/3661560; Device Package: 0603 (1608 Metric); Features: Low ESL; lastupdated: 9/2/2024 20:10:30; Lifecycle Status: Active; Minimum Order: 1; Mounting Type: Surface Mount, MLCC; Operating Temperature: -55°C ~ 85°C; Package / Case: 0603 (1608 Metric); packaging: TapeAndReel; partid: 2684; Part Status: Active; price: 0.08; series: C; Size / Dimension: 0.063" L x 0.031" W (1.60mm x 0.80mm); Supplier 1: DigiKey; Supplier Part Number 1: 445-9077-1-ND; Temperature Coefficient: X5R; Thickness (Max): 0.039" (1.00mm); value: 22 µF; Voltage - Rated: 10V
C60 = 885012206028: CAP CER 100PF 16V X7R 0603; manufacturer: Würth Elektronik; Tolerance: ±10%; Part Number: 885012206028; Capacitance: 100 pF; Applications: General Purpose; componentlink1description: Datasheet; componentlink1url: https://katalog.we-online.de/pbs/datasheet/885012206028.pdf; componentlink2description: DigiKey Link; componentlink2url: https://www.digikey.com/en/products/detail/würth-elektronik/885012206028/5453802; Device Package: 0603 (1608 Metric); lastupdated: 9/2/2024 20:10:28; Lifecycle Status: Active; Minimum Order: 1; Mounting Type: Surface Mount, MLCC; Operating Temperature: -55°C ~ 125°C; Package / Case: 0603 (1608 Metric); packaging: TapeAndReel; partid: 3600; Part Status: Active; price: 0.02; series: WCAP-CSGP; Size / Dimension: 0.063" L x 0.031" W (1.60mm x 0.80mm); Supplier 1: DigiKey; Supplier Part Number 1: 732-7947-1-ND; Temperature Coefficient: X7R; Thickness (Max): 0.034" (0.87mm); value: 100 pF; Voltage - Rated: 16V
D4 = SS54-HF: Diode Schottky 40 V 5A Surface Mount DO-214AC (SMA); MF: Comchip Technology; SnapEDA_Link: https://www.snapeda.com/parts/SS54-HF/Comchip/view-part/?ref=snap; Package: DO-214AC-214 Comchip Technology; Value: *; MP: SS54-HF; Check_prices: https://www.snapeda.com/parts/SS54-HF/Comchip/view-part/?ref=eda
L2 = SRP1265A-470M: Inductor,Shielded Power,AEC-Q200,47uH 20% SMT 1265 | Bourns SRP1265A-470M; SnapEDA_Link: https://www.snapeda.com/parts/SRP1265A-470M/Bourns/view-part/?ref=snap; Package: Nonstandard Bourns; Value: *; MF: Bourns; MP: SRP1265A-470M; Check_prices: https://www.snapeda.com/parts/SRP1265A-470M/Bourns/view-part/?ref=eda
R2 = RC0402FR-0756KL: RES 56K OHM 1% 1/16W 0402; Manufacturer: Yageo; Power (Watts): 0.063W, 1/16W; Temperature Coefficient: ±100ppm/°C; Part Number: RC0402FR-0756KL; Value: 56 kOhms; ComponentLink1Description: Datasheet; ComponentLink1URL: https://www.yageo.com/upload/media/product/productsearch/datasheet/rchip/PYu-RC_Group_51_RoHS_L_10.pdf; ComponentLink2Description: DigiKey Link; ComponentLink2URL: https://www.digikey.com/en/products/detail/yageo/RC0402FR-0756KL/726635; Composition: Thick Film; Device Package: 0402 (1005 Metric); Features: Moisture Resistant; Height - Seated (Max): 0.016" (0.40mm); LastUpdated: 31/8/2025 15:04:18; Lifecycle Status: Active; Minimum Order: 1; Number of Terminations: 2; Operating Temperature: -55°C ~ 155°C; Package / Case: 0402 (1005 Metric); Packaging: CutTape; PartId: 2502; Part Status: Active; Price: 0.01; Resistance: 56 kOhms; Series: RC_L; Size / Dimension: 0.039" L x 0.020" W (1.00mm x 0.50mm); Supplier 1: DigiKey; Supplier Part Number 1: 311-56.0KLRCT-ND; Supplier Device Package: 0402; Tolerance: ±1%
R11 = RC0402FR-0782KL: RES 82K OHM 1% 1/16W 0402; Manufacturer: Yageo; Power (Watts): 0.063W, 1/16W; Temperature Coefficient: ±100ppm/°C; Part Number: RC0402FR-0782KL; Value: 82 kOhms; ComponentLink1Description: Datasheet; ComponentLink1URL: https://www.yageo.com/upload/media/product/productsearch/datasheet/rchip/PYu-RC_Group_51_RoHS_L_10.pdf; ComponentLink2Description: DigiKey Link; ComponentLink2URL: https://www.digikey.com/en/products/detail/yageo/RC0402FR-0782KL/726665; Composition: Thick Film; Device Package: 0402 (1005 Metric); Features: Moisture Resistant; Height - Seated (Max): 0.016" (0.40mm); LastUpdated: 31/8/2025 15:04:18; Lifecycle Status: Active; Minimum Order: 1; Number of Terminations: 2; Operating Temperature: -55°C ~ 155°C; Package / Case: 0402 (1005 Metric); Packaging: CutTape; PartId: 2509; Part Status: Active; Price: 0.01; Resistance: 82 kOhms; Series: RC_L; Size / Dimension: 0.039" L x 0.020" W (1.00mm x 0.50mm); Supplier 1: DigiKey; Supplier Part Number 1: 311-82.0KLRCT-ND; Supplier Device Package: 0402; Tolerance: ±1%
R22 = RT0603FRE074K7L: RES SMD 4.7K OHM 1% 1/10W 0603; Manufacturer: Yageo; Power (Watts): 0.1W, 1/10W; Temperature Coefficient: ±50ppm/°C; Part Number: RT0603FRE074K7L; Value: 4.7 kOhms; ComponentLink1Description: Datasheet; ComponentLink1URL: https://www.yageo.com/upload/media/product/productsearch/datasheet/rchip/PYu-RT_1-to-0.01_RoHS_L_11.pdf; ComponentLink2Description: DigiKey Link; ComponentLink2URL: https://www.digikey.com/en/products/detail/yageo/RT0603FRE074K7L/1075404; Composition: Thin Film; Device Package: 0603 (1608 Metric); Height - Seated (Max): 0.022" (0.55mm); LastUpdated: 25/7/2024 09:19:32; Lifecycle Status: Active; Minimum Order: 1; Number of Terminations: 2; Operating Temperature: -55°C ~ 155°C; Package / Case: 0603 (1608 Metric); Packaging: TapeAndReel; PartId: 5678; Part Status: Active; Price: 0.01; Resistance: 4.7 kOhms; Series: RT; Size / Dimension: 0.063" L x 0.031" W (1.60mm x 0.80mm); Supplier 1: DigiKey; Supplier Part Number 1: YAG1238CT-ND; Supplier Device Package: 0603; Tolerance: ±1%
R30 = RT0603FRE071K2L: RES SMD 1.2K OHM 1% 1/10W 0603; Manufacturer: Yageo; Power (Watts): 0.1W, 1/10W; Temperature Coefficient: ±50ppm/°C; Part Number: RT0603FRE071K2L; Value: 1.2 kOhms; ComponentLink1Description: Datasheet; ComponentLink1URL: https://www.yageo.com/upload/media/product/productsearch/datasheet/rchip/PYu-RT_1-to-0.01_RoHS_L_11.pdf; ComponentLink2Description: DigiKey Link; ComponentLink2URL: https://www.digikey.com/en/products/detail/yageo/RT0603FRE071K2L/1075167; Composition: Thin Film; Device Package: 0603 (1608 Metric); Height - Seated (Max): 0.022" (0.55mm); LastUpdated: 25/7/2024 09:19:32; Lifecycle Status: Active; Minimum Order: 1; Number of Terminations: 2; Operating Temperature: -55°C ~ 155°C; Package / Case: 0603 (1608 Metric); Packaging: TapeAndReel; PartId: 5172; Part Status: Active; Price: 0.01; Resistance: 1.2 kOhms; Series: RT; Size / Dimension: 0.063" L x 0.031" W (1.60mm x 0.80mm); Supplier 1: DigiKey; Supplier Part Number 1: YAG5943CT-ND; Supplier Device Package: 0603; Tolerance: ±1%
R35 = RNCS0603BKE100K: as R6 on sheet RTU_LMG_ORing3V3; Part Number: RNCS0603BKE100K; Value: 100 kOhms; ComponentLink1Description: Datasheet; ComponentLink1URL: https://www.seielect.com/catalog/sei-rncs_rnch.pdf; ComponentLink2Description: DigiKey Link; ComponentLink2URL: https://www.digikey.com/en/products/detail/stackpole-electronics-inc/RNCS0603BKE100K/1708835; Composition: Thin Film; Device Package: 0603 (1608 Metric); Features: Anti-Corrosive, Automotive AEC-Q200, Moisture Resistant; Height - Seated (Max): 0.022" (0.55mm); LastUpdated: 9/2/2024 20:43:37; Lifecycle Status: Active; Minimum Order: 1; Number of Terminations: 2; Operating Temperature: -55°C ~ 155°C; Package / Case: 0603 (1608 Metric); Packaging: TapeAndReel; PartId: 4849; Part Status: Active; Price: 0.06; Ratings: AEC-Q200; Resistance: 100 kOhms; Series: RNCS; Size / Dimension: 0.061" L x 0.031" W (1.55mm x 0.80mm); Supplier 1: DigiKey; Supplier Part Number 1: RNCS0603BKE100KCT-ND; Supplier Device Package: 0603; Tolerance: ±0.1%
U7 = LM2596DSADJG: LM2596DSADJG Switching Regulator 3A Adjustable, 1.23 to 37 V, 5-Pin D2PAK | ON Semiconductor LM2596DSADJG; SnapEDA_Link: https://www.snapeda.com/parts/LM2596DSADJG/Onsemi/view-part/?ref=snap; Package: D2PAK-5 ON Semiconductor; Value: *; MF: ON Semiconductor; MP: LM2596DSADJG; Check_prices: https://www.snapeda.com/parts/LM2596DSADJG/Onsemi/view-part/?ref=eda; ComponentLink1Description: https://www.digikey.com/en/products/detail/taejin/LM2596R-5-0/22237253; ComponentLink1URL: *

## Sheet RTU_LMG_DI.SchDoc
size A3; SheetNumber: 15; SheetTotal: 16
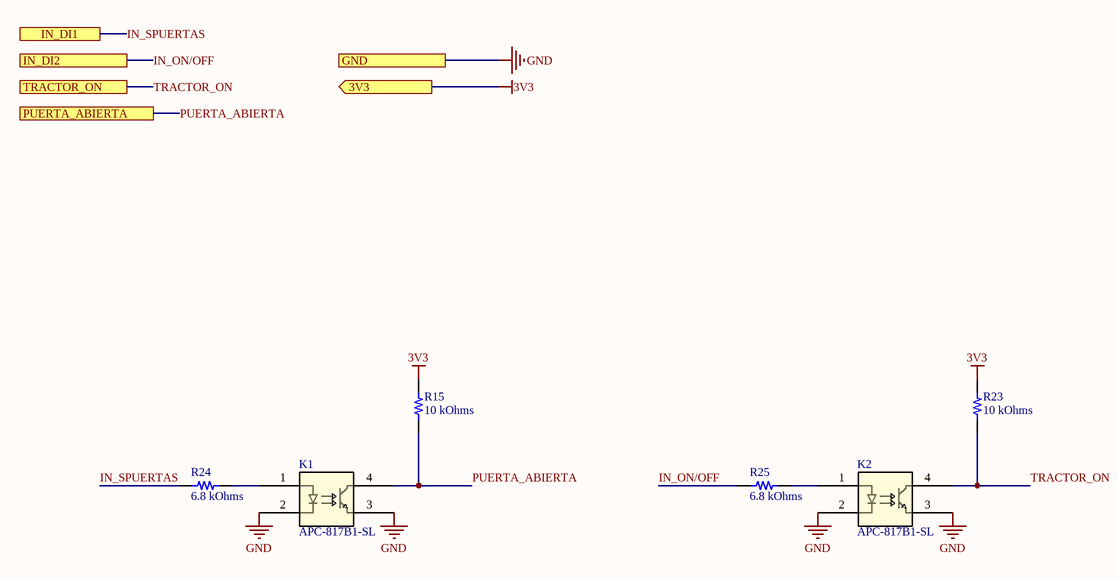
[diagram p13: RTU_LMG_DI.SchDoc]

### Parts
K1  APC-817B1-SL  [APC-817xx-SL_AMB]
K2  APC-817B1-SL  [APC-817xx-SL_AMB]
R15  10 kOhms  [RES 0603_1608]
R23  10 kOhms  [RES 0603_1608]
R24  6.8 kOhms  [RES 0603_1608]
R25  6.8 kOhms  [RES 0603_1608]

### Ports
3V3 (out), GND, IN_DI1, IN_DI2, PUERTA_ABIERTA, TRACTOR_ON

### Nets
3V3: R15.2 R23.2 ; port 3V3
GND: K1.2 K1.3 K2.2 K2.3 ; port GND
IN_ON/OFF: R25.1 ; port IN_DI2
IN_SPUERTAS: R24.1 ; port IN_DI1
PUERTA_ABIERTA: K1.4 R15.1 ; port PUERTA_ABIERTA
TRACTOR_ON: K2.4 R23.1 ; port TRACTOR_ON
NetK1_1: K1.1 R24.2
NetK2_1: K2.1 R25.2

### Library data of the parts
K1 K2 = APC-817B1-SL: Description; Manufacturer_Name: American Bright; Type: Optoisolators; Copyright: Copyright (C) 2025 Ultra Librarian. All rights reserved.; Manufacturer_Part_Number: APC-817B1-SL; RefDes: RefDes
R15 R23 = RC0603FR-0710KL: as R18 on sheet RTU_LMG_LoRa_Module; Part Number: RC0603FR-0710KL; Value: 10 kOhms; ComponentLink1Description: Datasheet; ComponentLink1URL: https://www.yageo.com/upload/media/product/productsearch/datasheet/rchip/PYu-RC_Group_51_RoHS_L_10.pdf; ComponentLink2Description: DigiKey Link; ComponentLink2URL: https://www.digikey.com/en/products/detail/yageo/RC0603FR-0710KL/726880; Composition: Thick Film; Device Package: 0603 (1608 Metric); Features: Moisture Resistant; Height - Seated (Max): 0.022" (0.55mm); LastUpdated: 10/30/2023 7:36:43 PM; Lifecycle Status: Active; Minimum Order: 1; Number of Terminations: 2; Operating Temperature: -55°C ~ 155°C; Package / Case: 0603 (1608 Metric); Packaging: CutTape; PartId: 22599; Part Status: Active; Price: 0.01; Resistance: 10 kOhms; Series: RC_L; Size / Dimension: 0.063" L x 0.031" W (1.60mm x 0.80mm); Supplier 1: DigiKey; Supplier Part Number 1: 311-10.0KHRCT-ND; Supplier Device Package: 0603; Tolerance: ±1%
R24 R25 = RMCF0603JT6K80: RES 6.8K OHM 5% 1/10W 0603; Manufacturer: Stackpole Electronics Inc; Power (Watts): 0.1W, 1/10W; Temperature Coefficient: ±200ppm/°C; Part Number: RMCF0603JT6K80; Value: 6.8 kOhms; ComponentLink1Description: Datasheet; ComponentLink1URL: https://www.seielect.com/catalog/sei-rmcf_rmcp.pdf; ComponentLink2Description: DigiKey Link; ComponentLink2URL: https://www.digikey.com/en/products/detail/stackpole-electronics-inc/RMCF0603JT6K80/1757963; Composition: Thick Film; Device Package: 0603 (1608 Metric); Features: Automotive AEC-Q200; Height - Seated (Max): 0.022" (0.55mm); LastUpdated: 9/2/2024 20:43:33; Lifecycle Status: Active; Minimum Order: 1; Number of Terminations: 2; Operating Temperature: -55°C ~ 155°C; Package / Case: 0603 (1608 Metric); Packaging: CutTape; PartId: 5918; Part Status: Active; Price: 0.01; Ratings: AEC-Q200; Resistance: 6.8 kOhms; Series: RMCF; Size / Dimension: 0.061" L x 0.031" W (1.55mm x 0.80mm); Supplier 1: DigiKey; Supplier Part Number 1: RMCF0603JT6K80CT-ND; Supplier Device Package: 0603; Tolerance: ±5%